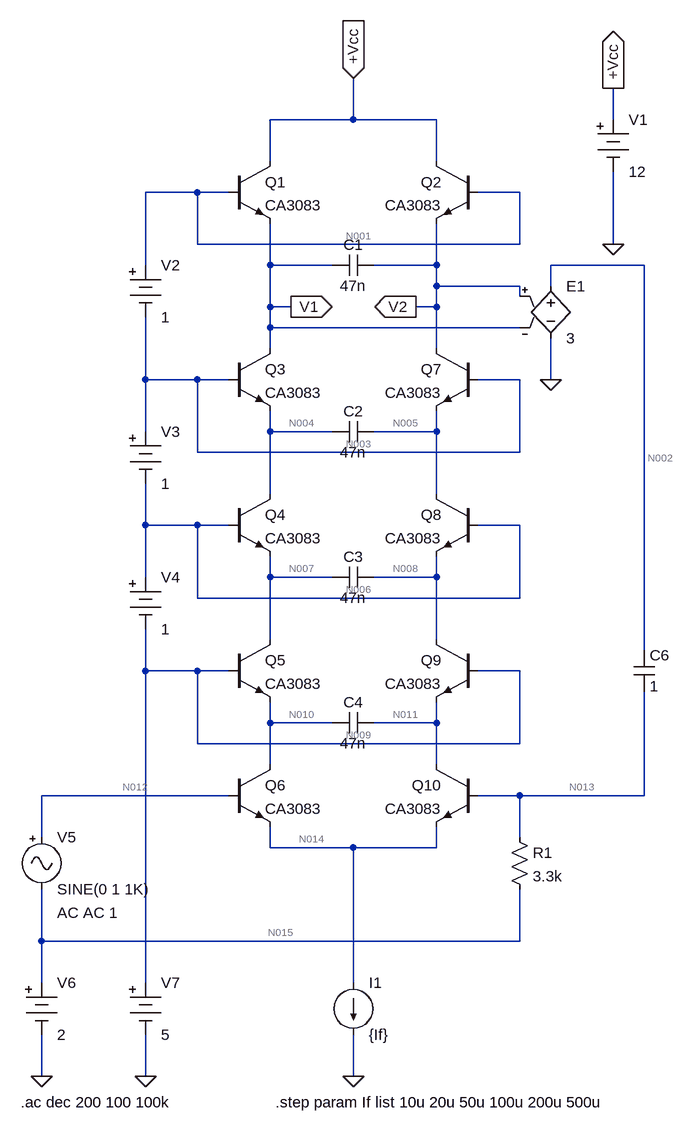
[diagram p0: schematic Moog Ladder Filter.asc]
Moog Ladder Filter.asc, the LTspice schematic file:
Version 4
SHEET 1 932 1576
WIRE 0 48 0 -16
WIRE 0 48 -128 48
WIRE 128 48 0 48
WIRE 400 48 400 0
WIRE -128 112 -128 48
WIRE 128 112 128 48
WIRE -240 160 -320 160
WIRE -192 160 -240 160
WIRE 256 160 192 160
WIRE -240 240 -240 160
WIRE 256 240 256 160
WIRE 256 240 -240 240
WIRE 400 240 400 128
WIRE -320 272 -320 160
WIRE -128 272 -128 208
WIRE -32 272 -128 272
WIRE 128 272 128 208
WIRE 128 272 32 272
WIRE 448 272 304 272
WIRE 128 304 128 272
WIRE 256 304 128 304
WIRE 304 304 304 272
WIRE 256 320 256 304
WIRE -128 336 -128 272
WIRE -96 336 -128 336
WIRE 128 336 128 304
WIRE 128 336 96 336
WIRE -128 368 -128 336
WIRE 256 368 -128 368
WIRE -128 400 -128 368
WIRE 128 400 128 336
WIRE -320 448 -320 352
WIRE -240 448 -320 448
WIRE -192 448 -240 448
WIRE 256 448 192 448
WIRE 304 448 304 384
WIRE -320 528 -320 448
WIRE -128 528 -128 496
WIRE -32 528 -128 528
WIRE 128 528 128 496
WIRE 128 528 32 528
WIRE -240 560 -240 448
WIRE 256 560 256 448
WIRE 256 560 -240 560
WIRE -128 624 -128 528
WIRE 128 624 128 528
WIRE -320 672 -320 608
WIRE -240 672 -320 672
WIRE -192 672 -240 672
WIRE 256 672 192 672
WIRE -320 752 -320 672
WIRE -128 752 -128 720
WIRE -32 752 -128 752
WIRE 128 752 128 720
WIRE 128 752 32 752
WIRE -240 784 -240 672
WIRE 256 784 256 672
WIRE 256 784 -240 784
WIRE -128 848 -128 752
WIRE 128 848 128 752
WIRE 448 864 448 272
WIRE -320 896 -320 832
WIRE -240 896 -320 896
WIRE -192 896 -240 896
WIRE 256 896 192 896
WIRE -128 976 -128 944
WIRE -32 976 -128 976
WIRE 128 976 128 944
WIRE 128 976 32 976
WIRE -240 1008 -240 896
WIRE 256 1008 256 896
WIRE 256 1008 -240 1008
WIRE -128 1040 -128 976
WIRE 128 1040 128 976
WIRE -192 1088 -480 1088
WIRE 256 1088 192 1088
WIRE 448 1088 448 928
WIRE 448 1088 256 1088
WIRE -480 1152 -480 1088
WIRE 256 1152 256 1088
WIRE -128 1168 -128 1136
WIRE 0 1168 -128 1168
WIRE 128 1168 128 1136
WIRE 128 1168 0 1168
WIRE -480 1312 -480 1232
WIRE 256 1312 256 1232
WIRE 256 1312 -480 1312
WIRE -480 1376 -480 1312
WIRE -320 1376 -320 896
WIRE 0 1376 0 1168
WIRE -480 1520 -480 1456
WIRE -320 1520 -320 1456
WIRE 0 1520 0 1456
FLAG 400 0 +Vcc
IOPIN 400 0 Out
FLAG 400 240 0
FLAG 0 -16 +Vcc
IOPIN 0 -16 In
FLAG -96 336 V1
IOPIN -96 336 Out
FLAG 96 336 V2
IOPIN 96 336 Out
FLAG -480 1520 0
FLAG -320 1520 0
FLAG 0 1520 0
FLAG 304 448 0
SYMBOL e 304 288 R0
SYMATTR InstName E1
SYMATTR Value 3
SYMBOL npn -192 112 R0
SYMATTR InstName Q1
SYMATTR Value CA3083
SYMBOL npn 192 112 M0
SYMATTR InstName Q2
SYMATTR Value CA3083
SYMBOL Misc\\battery 400 32 R0
WINDOW 123 0 0 Left 0
WINDOW 39 0 0 Left 0
SYMATTR InstName V1
SYMATTR Value 12
SYMBOL Misc\\battery -320 256 R0
WINDOW 123 0 0 Left 0
WINDOW 39 0 0 Left 0
SYMATTR InstName V2
SYMATTR Value 1
SYMBOL cap 32 256 R90
WINDOW 0 0 32 VBottom 2
WINDOW 3 32 32 VTop 2
SYMATTR InstName C1
SYMATTR Value 47n
SYMBOL cap -32 544 R270
WINDOW 0 32 32 VTop 2
WINDOW 3 0 32 VBottom 2
SYMATTR InstName C2
SYMATTR Value 47n
SYMBOL cap -32 768 R270
WINDOW 0 32 32 VTop 2
WINDOW 3 0 32 VBottom 2
SYMATTR InstName C3
SYMATTR Value 47n
SYMBOL Misc\\battery -320 512 R0
WINDOW 123 0 0 Left 0
WINDOW 39 0 0 Left 0
SYMATTR InstName V3
SYMATTR Value 1
SYMBOL cap -32 992 R270
WINDOW 0 32 32 VTop 2
WINDOW 3 0 32 VBottom 2
SYMATTR InstName C4
SYMATTR Value 47n
SYMBOL Misc\\battery -320 736 R0
WINDOW 123 0 0 Left 0
WINDOW 39 0 0 Left 0
SYMATTR InstName V4
SYMATTR Value 1
SYMBOL cap 432 864 R0
SYMATTR InstName C6
SYMATTR Value 1
SYMBOL res 240 1136 R0
SYMATTR InstName R1
SYMATTR Value 3.3k
SYMBOL Misc\\signal -480 1136 R0
WINDOW 123 24 132 Left 2
WINDOW 39 0 0 Left 0
SYMATTR Value2 AC AC 1
SYMATTR InstName V5
SYMBOL Misc\\battery -480 1360 R0
WINDOW 123 0 0 Left 0
WINDOW 39 0 0 Left 0
SYMATTR InstName V6
SYMATTR Value 2
SYMBOL Misc\\battery -320 1360 R0
WINDOW 123 0 0 Left 0
WINDOW 39 0 0 Left 0
SYMATTR InstName V7
SYMATTR Value 5
SYMBOL current 0 1376 R0
WINDOW 123 0 0 Left 0
WINDOW 39 0 0 Left 0
SYMATTR InstName I1
SYMATTR Value {If}
SYMBOL npn -192 400 R0
SYMATTR InstName Q3
SYMATTR Value CA3083
SYMBOL npn -192 624 R0
SYMATTR InstName Q4
SYMATTR Value CA3083
SYMBOL npn -192 848 R0
SYMATTR InstName Q5
SYMATTR Value CA3083
SYMBOL npn -192 1040 R0
SYMATTR InstName Q6
SYMATTR Value CA3083
SYMBOL npn 192 400 M0
SYMATTR InstName Q7
SYMATTR Value CA3083
SYMBOL npn 192 624 M0
SYMATTR InstName Q8
SYMATTR Value CA3083
SYMBOL npn 192 848 M0
SYMATTR InstName Q9
SYMATTR Value CA3083
SYMBOL npn 192 1040 M0
SYMATTR InstName Q10
SYMATTR Value CA3083
TEXT -512 1560 Left 2 !.ac dec 200 100 100k
TEXT -120 1560 Left 2 !.step param If list 10u 20u 50u 100u 200u 500u

The netlist it stands for:
* Moog Ladder Filter.asc
E1 N002 0 V2 V1 3
Q1 +Vcc N001 V1 0 CA3083
Q2 +Vcc N001 V2 0 CA3083
V1 +Vcc 0 12
V2 N001 N003 1
C1 V2 V1 47n
C2 N004 N005 47n
C3 N007 N008 47n
V3 N003 N006 1
C4 N010 N011 47n
V4 N006 N009 1
C6 N002 N013 1
R1 N013 N015 3.3k
V5 N012 N015 SINE(0 1 1K) AC AC 1
V6 N015 0 2
V7 N009 0 5
I1 N014 0 {If}
Q3 V1 N003 N004 0 CA3083
Q4 N004 N006 N007 0 CA3083
Q5 N007 N009 N010 0 CA3083
Q6 N010 N012 N014 0 CA3083
Q7 V2 N003 N005 0 CA3083
Q8 N005 N006 N008 0 CA3083
Q9 N008 N009 N011 0 CA3083
Q10 N011 N013 N014 0 CA3083
.model NPN NPN
.model PNP PNP
.lib standard.bjt
.ac dec 200 100 100k
.step param If list 10u 20u 50u 100u 200u 500u
.backanno
.end

* Results of the author's LTspice run, read from the files saved beside the schematic
* Operating Point (first step), zero values left out:
*   if = 10 µA
*   V(n002) = 16.12 mV
*   V(v2) = 7.529 V
*   V(v1) = 7.523 V
*   V(+vcc) = 12 V
*   V(n001) = 8 V
*   V(n003) = 7 V
*   V(n004) = 6.512 V
*   V(n005) = 6.517 V
*   V(n007) = 5.503 V
*   V(n008) = 5.508 V
*   V(n006) = 6 V
*   V(n010) = 4.495 V
*   V(n011) = 4.499 V
*   V(n009) = 5 V
*   V(n013) = 1.996 V
*   V(n015) = 2 V
*   V(n012) = 2 V
*   V(n014) = 1.488 V
*   Ic(Q1) = 1.052 µA
*   Ib(Q1) = 481.8 nA
*   Ie(Q1) = -1.534 µA
*   Ic(Q2) = 854.6 nA
*   Ib(Q2) = 415.3 nA
*   Ie(Q2) = -1.27 µA
*   Ic(Q3) = 1.534 µA
*   Ib(Q3) = 646.6 nA
*   Ie(Q3) = -2.18 µA
*   Ic(Q4) = 2.18 µA
*   Ib(Q4) = 831.8 nA
*   Ie(Q4) = -3.012 µA
*   Ic(Q5) = 3.012 µA
*   Ib(Q5) = 1.049 µA
*   Ie(Q5) = -4.061 µA
*   Ic(Q6) = 4.061 µA
*   Ib(Q6) = 1.281 µA
*   Ie(Q6) = -5.342 µA
*   Ic(Q7) = 1.27 µA
*   Ib(Q7) = 564.9 nA
*   Ie(Q7) = -1.835 µA
*   Ic(Q8) = 1.835 µA
*   Ib(Q8) = 735.1 nA
*   Ie(Q8) = -2.57 µA
*   Ic(Q9) = 2.57 µA
*   Ib(Q9) = 935.8 nA
*   Ie(Q9) = -3.506 µA
*   Ic(Q10) = 3.506 µA
*   Ib(Q10) = 1.153 µA
*   Ie(Q10) = -4.658 µA
*   I(C6) = -1.98 pA
*   I(I1) = 10 µA
*   I(R1) = -1.153 µA
*   I(E1) = 1.98 pA
*   I(V1) = -1.906 µA
*   I(V2) = -897.2 nA
*   I(V3) = -2.109 µA
*   I(V4) = -3.676 µA
*   I(V5) = -1.281 µA
*   I(V6) = -2.434 µA
*   I(V7) = -5.66 µA
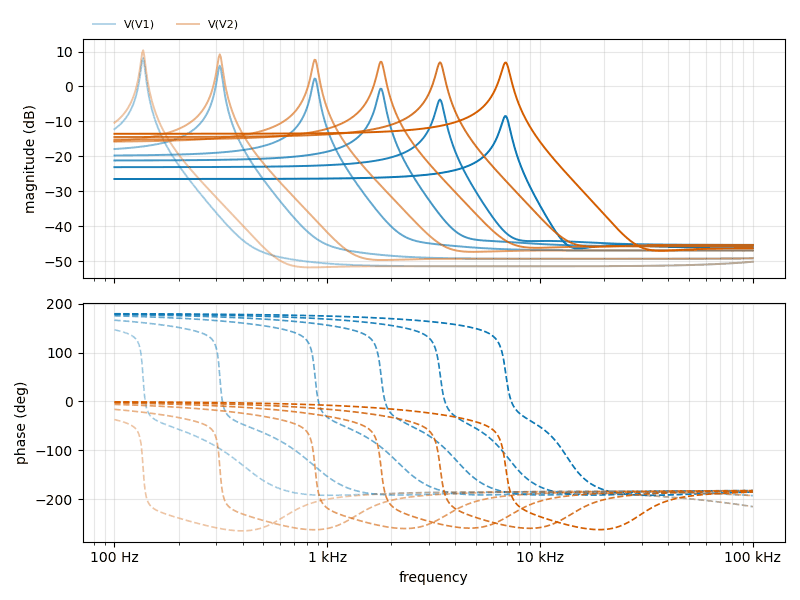
[diagram p1: AC Analysis of Moog Ladder Filter.asc, plotted from the saved traces]
* AC Analysis, 6 runs:
*   V(V1) [if=1e-05]: -12.19 dB at 100 Hz, -50.12 dB at 100 kHz, peak 8.15 dB at 136.5 Hz, 3 dB below the peak at 133.3 Hz and 139 Hz
*   V(V1) [if=2e-05]: -17.89 dB at 100 Hz, -49.15 dB at 100 kHz, peak 5.95 dB at 312.6 Hz, 3 dB below the peak at 304.8 Hz and 320.1 Hz
*   V(V1) [if=5e-05]: -19.74 dB at 100 Hz, -46.91 dB at 100 kHz, peak 2.26 dB at 871 Hz, 3 dB below the peak at 846.4 Hz and 902.6 Hz
*   V(V1) [if=0.0001]: -21.16 dB at 100 Hz, -45.72 dB at 100 kHz, peak -0.64 dB at 1.778 kHz, 3 dB below the peak at 1.719 kHz and 1.851 kHz
*   V(V1) [if=0.0002]: -23.07 dB at 100 Hz, -45.31 dB at 100 kHz, peak -3.73 dB at 3.388 kHz, 3 dB below the peak at 3.243 kHz and 3.518 kHz
*   V(V1) [if=0.0005]: -26.46 dB at 100 Hz, -46.22 dB at 100 kHz, peak -8.49 dB at 6.918 kHz, 3 dB below the peak at 6.55 kHz and 7.177 kHz
*   V(V2) [if=1e-05]: -10.38 dB at 100 Hz, -50.12 dB at 100 kHz, peak 10.35 dB at 136.5 Hz, 3 dB below the peak at 133.4 Hz and 139 Hz
*   V(V2) [if=2e-05]: -15.61 dB at 100 Hz, -49.15 dB at 100 kHz, peak 9.20 dB at 312.6 Hz, 3 dB below the peak at 304.9 Hz and 320.2 Hz
*   V(V2) [if=5e-05]: -15.76 dB at 100 Hz, -46.91 dB at 100 kHz, peak 7.63 dB at 871 Hz, 3 dB below the peak at 846.9 Hz and 903.2 Hz
*   V(V2) [if=0.0001]: -15.18 dB at 100 Hz, -45.72 dB at 100 kHz, peak 7.05 dB at 1.778 kHz, 3 dB below the peak at 1.72 kHz and 1.853 kHz
*   V(V2) [if=0.0002]: -14.45 dB at 100 Hz, -45.32 dB at 100 kHz, peak 6.91 dB at 3.388 kHz, 3 dB below the peak at 3.249 kHz and 3.523 kHz
*   V(V2) [if=0.0005]: -13.53 dB at 100 Hz, -46.27 dB at 100 kHz, peak 6.85 dB at 6.918 kHz, 3 dB below the peak at 6.569 kHz and 7.19 kHz